# Altium schematic sheet notch+out.SchDoc
size A; SheetNumber: 5; SheetTotal: 5
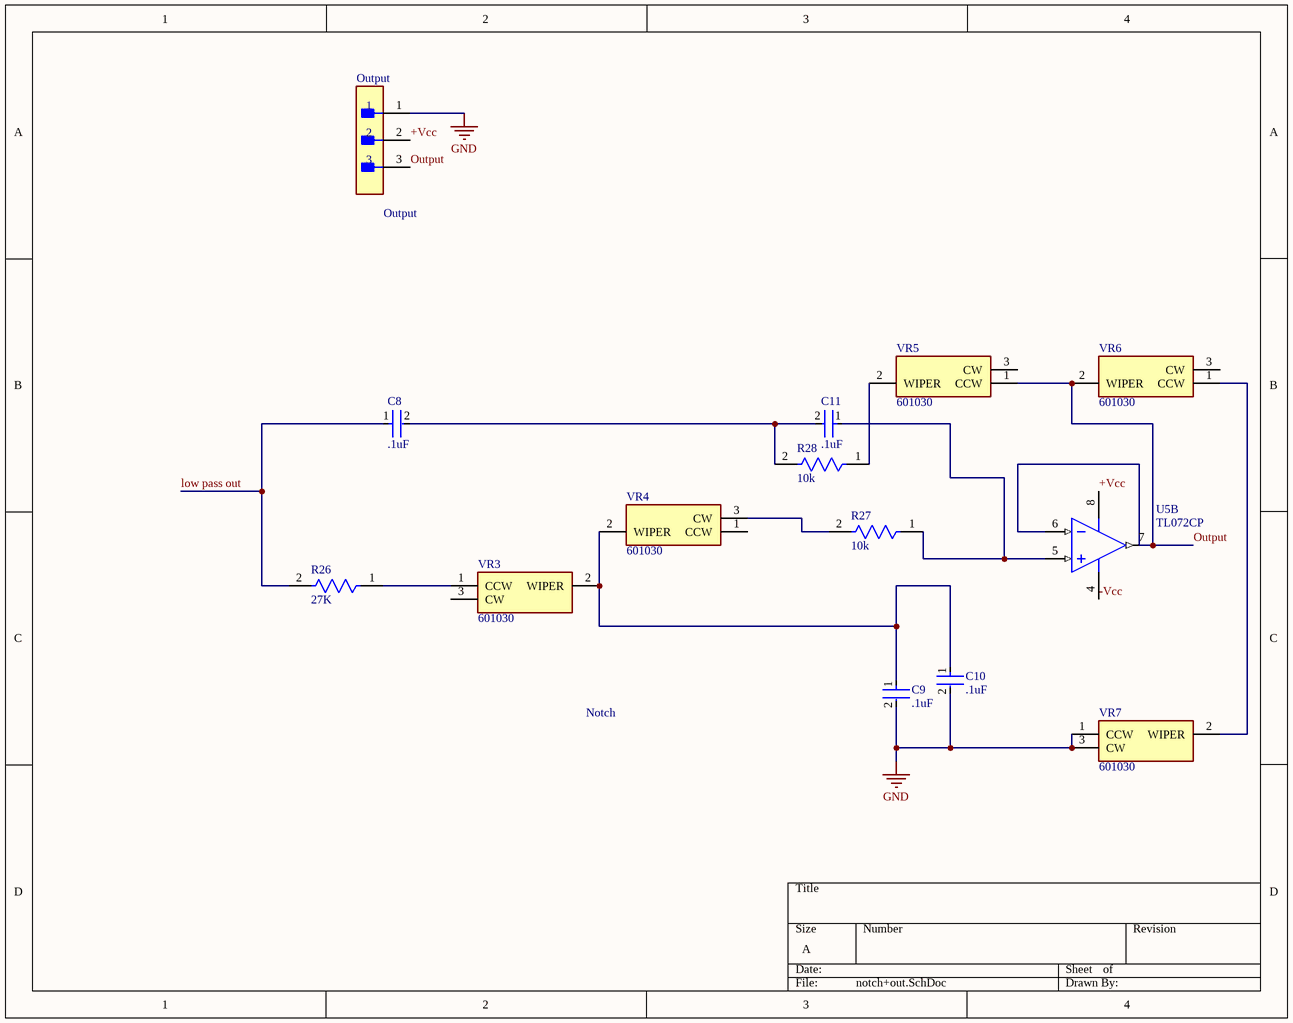
[diagram p0: notch+out.SchDoc]

## Parts
C8  .1uF  [FP-K15H5-MFG]
C9  .1uF  [FP-K15H5-MFG]
C10  .1uF  [FP-K15H5-MFG]
C11  .1uF  [FP-K15H5-MFG]
Output  87224-3  [FP-87224-3-MFG]  (value not drawn)
R26  27K  [FP-CFR-25-MFG]
R27  10k  [FP-CFR-25-MFG]
R28  10k  [FP-CFR-25-MFG]
U5  TL072CP  [P0008A]  (part B of 2)
VR3  601030  [601030]
VR4  601030  [601030]
VR5  601030  [601030]
VR6  601030  [601030]
VR7  601030  [601030]

## Nets
GND: C9.2 C10.2 Output.1 VR7.1(CCW) VR7.3(CW)
+Vcc: Output.2 U5.8(VCC+)
-Vcc: U5.4(VCC-)
low pass out: C8.1 R26.2
Output: Output.3 U5.6(IN2-) U5.7(OUT2) VR5.1(CCW) VR6.2(WIPER)
NetC8_2: C8.2 C11.2 R28.2
NetC9_1: C9.1 C10.1 VR3.2(WIPER) VR4.2(WIPER)
NetC11_1: C11.1 R27.1 U5.5(IN2+)
NetR26_1: R26.1 VR3.1(CCW)
NetR27_2: R27.2 VR4.3(CW)
NetR28_1: R28.1 VR5.2(WIPER)
NetVR6_1: VR6.1(CCW) VR7.2(WIPER)

Not connected (* = marked no-connect by the designer): VR3 3(CW); VR4 1(CCW); VR5 3(CW); VR6 3(CW)

## Notes on the sheet
- (near Output) Output
- Notch

## Library data of the parts
C8-C11 = CMP-02417-000048-1: CAP CER 0.1UF 50V X7R RADIAL; Capacitance: 100nF; Tolerance: 10%; Lead/Base Style: Formed Leads; Lead Length: 30mm; Lead Diameter: 0.5mm; Radiation Hardening: No; Lead Pitch: 5mm; Voltage: 50V; Mount: Through Hole; Package Quantity: 5000; Series: K; Case/Package: Dipped; Min Operating Temperature: -55°C; Depth: 2.5mm; Height - Seated (Max): 0.1inch; Voltage Rating (DC): 50V; Packaging: Bulk; RoHS Compliant: Yes; Construction: RADIAL; Thickness: 2.6mm; Max Operating Temperature: 125°C; Voltage Rating: 50V; Diameter: 500um; Dielectric: X7R; Width: 2.5mm; Length: 4mm; Weight: 0.005644oz; Termination: Radial; Height: 4mm
Output = CMP-2000-05697-2: CONN HEADER VERT 3POS 2.54MM; Number of Positions: 3; Gasket: No (Without); High Speed Serial Data Connector: No; Current Rating: 3A; Contact Post Length: 0.125inch; PCB Thickness: 1.397mm; PCB Mount Retention: Without; Connector Type: Plug; Approvals: CSA; PCB Mounting Orientation: Vertical; Pitch: 2.54mm; Mating Alignment: No (Without); Housing Color: Black; Contact Gender: Male; Length: 7.21mm; Max Operating Temperature: 105°C; Strain Relief: No (Without); Contact Material: Bronze; Row Spacing: 2.54mm; Series: AMPMODU MOD II; Board Standoff: No (Without); Package Quantity: 520; Radiation Hardening: No; Contact Protection: No (Without); Stabilizers: No (Without); Number of Rows: 1; Contact Mating Length: 8.08mm; Contact Shape: Square; Depth: 2.54mm; Contact Current Rating: 3A; Flammability Rating: UL94 V-0; Packaging: Carton; Number of Contacts: 3; Orientation: Straight; Mount: Through Hole; Keyed: No; Contact Type: Male Pin; Housing Material: Thermoplastic; High Temperature Housing: No; ELV: Compliant; Contact Plating: Gold; Termination: Through Hole; Selectively Loaded: No (Without); Lead Free: Lead Free; Min Operating Temperature: -65°C; Mating Connector Lock: No (Without); Color: Black; RoHS Compliant: Yes
R26-R28 = CMP-03413-000009-1: RES 10 OHM 1/4W 5% AXIAL; Resistance: 10R; Temperature Coefficient: 500ppm/°C; Max Power Dissipation: 250mW; RoHS Compliant: Yes; Packaging: Bulk; Series: Carbon Film; Case/Package: Axial; Max Operating Temperature: 155°C; Min Operating Temperature: -55°C; Number of Terminations: 2; Length: 0.248inch; Resistor Type: Carbon Film; Tolerance: 5%; Package Quantity: 200
U5 = CMP-0017-00950-2: Dual Low-Noise JFET-Input General-Purpose Operational Amplifier, 7 to 36 V, 0 to 70 degC, 8-pin DIP (P8), Pb-Free (RoHS); Manufacturer: Texas Instruments; Sub Family: General Purpose Amplifier, High Supply Voltage Amplifier (>=30V); Total Supply Voltage(Max)(+5V is 5, +/-5V is 10): 36; Slew Rate(Typ)(V/us): 13; Vn at 1kHz(Typ)(nV/rtHz): 18; GBW(Typ)(MHz): 3; CMRR(Min)(dB): 70; Total Supply Voltage(Min)(+5V is 5, +/-5V is 10): 7; Vio (25C)(Max)(mV): 10; Rating: Catalog; IIB(Max)(pA): 200; Iq per channel(Max)(mA): 2.5; Number of Channels: 2; Mounting Technology: Through Hole; ComponentLink3Description: Package Specification; PartNumber: TL072CP; PackageVersion: 4040082/E, 04/2010; Eco-Plan: Pb-Free (RoHS); DatasheetVersion: SLOS080J; Offset Drift(Typ)(uV/C): 18; ComponentLink3URL: http://www.ti.com/litv/pdf/mpdi001b; PackageDescription: 8-Pin Plastic In-Line, Body 9.59 x 6.35 mm, Pitch 2.54 mm; Code_JEDEC: MS-001; ComponentLink2URL: http://www.ti.com/lit/ds/symlink/tl072.pdf; ComponentLink1Description: Manufacturer URL; ComponentLink2Description: Datasheet; ComponentLink1URL: http://www.ti.com/; PackageReference: P0008A
VR3-VR7 = 601030: Variable Resistor; Manufacturer_Name: AVX; Datasheet Link: https://www.abelektronik.de/fileadmin/images/Produkte_und_Datenblaetter/Datenblaetter/Bauelemente/E_HA06.pdf; Height: 7.8mm; Manufacturer_Part_Number: 601030; Mouser Part Number: 581-601030; Mouser Price/Stock: https://www.mouser.co.uk/ProductDetail/AVX/601030?qs=B6kkDfuK7%2FDwxok08zuurA%3D%3D